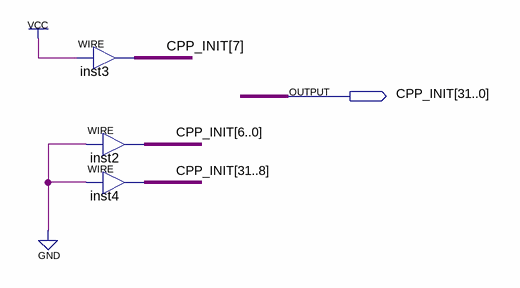
[diagram p0: schematic sheet]
// Quartus schematic CPP initial address.bdf as structural Verilog: 3 symbols, 1 pins
module \CPP_initial_address  (
  output [31:0] CPP_INIT
);

  assign CPP_INIT[7] = 1'b1;  // WIRE inst3
  assign CPP_INIT[6:0] = {7{1'b0}};  // WIRE inst2
  assign CPP_INIT[31:8] = {24{1'b0}};  // WIRE inst4
endmodule
